# EAGLE design lolo4-rc2 (EAGLE 7.6.0)
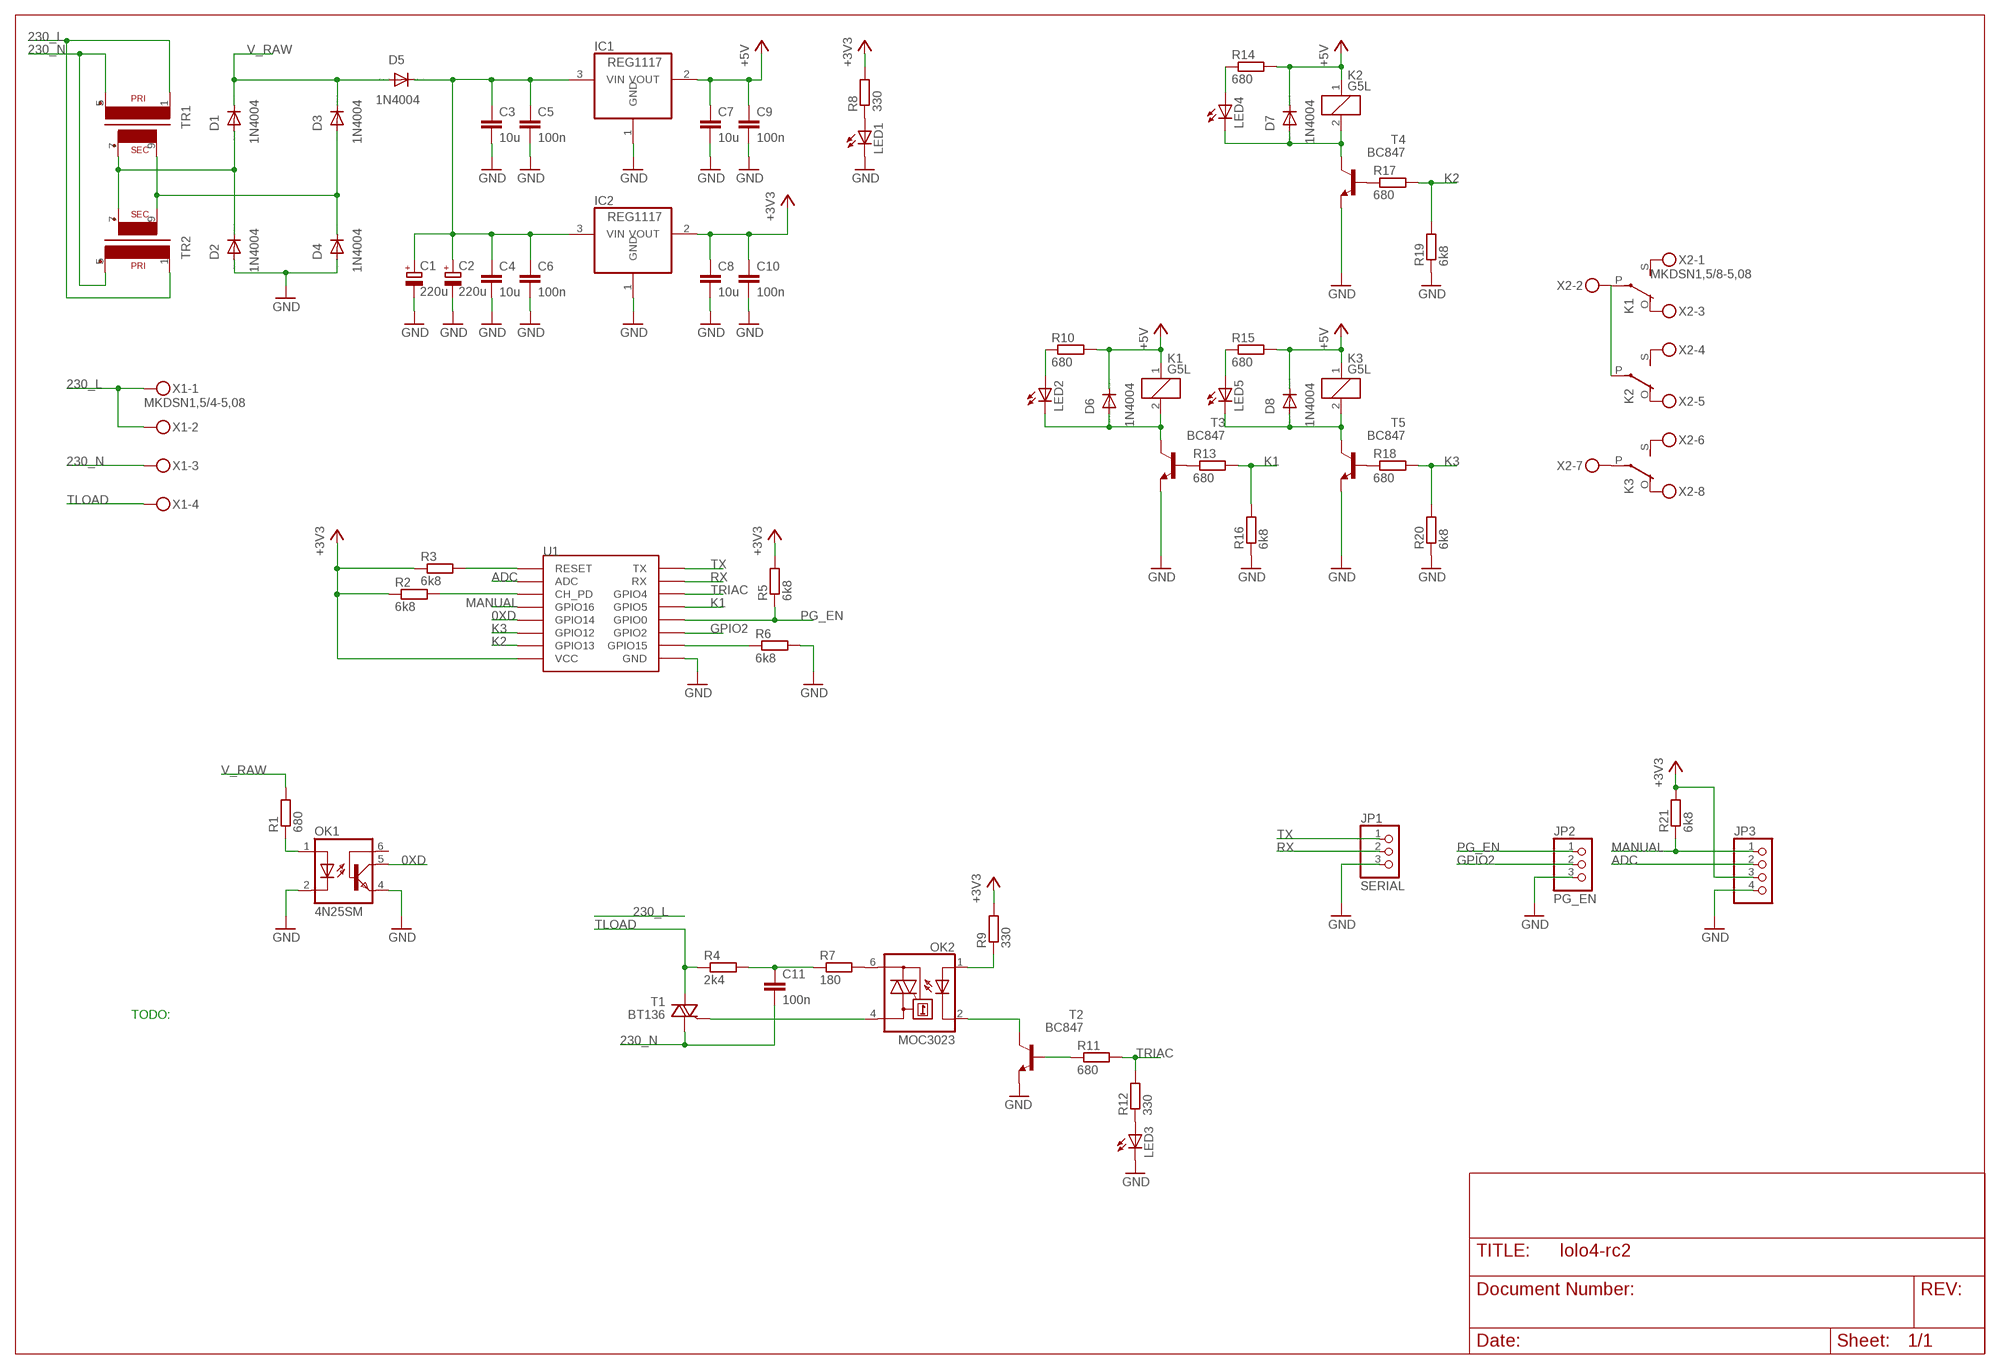
[diagram p0: schematic, sheet 1]

## Parts
C1  220u  CPOL-EUSANYO_SMD_E7  [SANYO-OSCON_SMD_E7]
C2  220u  CPOL-EUSANYO_SMD_E7  [SANYO-OSCON_SMD_E7]
C3  10u  C-EUC1206  [C1206]
C4  10u  C-EUC1206  [C1206]
C5  100n  C-EUC1206  [C1206]
C6  100n  C-EUC1206  [C1206]
C7  10u  C-EUC1206  [C1206]
C8  10u  C-EUC1206  [C1206]
C9  100n  C-EUC1206  [C1206]
C10  100n  C-EUC1206  [C1206]
C11  100n  C-EU150-054X183  [C150-054X183]
D1  1N4004  [DO41-10]
D2  1N4004  [DO41-10]
D3  1N4004  [DO41-10]
D4  1N4004  [DO41-10]
D5  1N4004  [DO41-10]
D6  1N4004  [DO41-10]
D7  1N4004  [DO41-10]
D8  1N4004  [DO41-10]
IC1  REG1117  [SOT223]
IC2  REG1117  [SOT223]
JP1  SERIAL  PINHD-1X3  [1X03]
JP2  PG_EN  PINHD-1X3  [1X03]
JP3  PINHD-1X4  [1X04]
K1  G5L  [G5LE]
K2  G5L  [G5LE]
K3  G5L  [G5LE]
LED1  LEDSML1206  [SML1206]
LED2  LEDSML1206  [SML1206]
LED3  LEDSML1206  [SML1206]
LED4  LEDSML1206  [SML1206]
LED5  LEDSML1206  [SML1206]
OK1  4N25SM  [DIL6-SMD]
OK2  MOC3023  MOC3031S  [DIL6-SMD]
R1  680  R-EU_R1206  [R1206]
R2  6k8  R-EU_R1206  [R1206]
R3  6k8  R-EU_R1206  [R1206]
R4  2k4  R-EU_0207/7  [0207/7]
R5  6k8  R-EU_R1206  [R1206]
R6  6k8  R-EU_R1206  [R1206]
R7  180  R-EU_0207/7  [0207/7]
R8  330  R-EU_R1206  [R1206]
R9  330  R-EU_R1206  [R1206]
R10  680  R-EU_R1206  [R1206]
R11  680  R-EU_R1206  [R1206]
R12  330  R-EU_R1206  [R1206]
R13  680  R-EU_R1206  [R1206]
R14  680  R-EU_R1206  [R1206]
R15  680  R-EU_R1206  [R1206]
R16  6k8  R-EU_R1206  [R1206]
R17  680  R-EU_R1206  [R1206]
R18  680  R-EU_R1206  [R1206]
R19  6k8  R-EU_R1206  [R1206]
R20  6k8  R-EU_R1206  [R1206]
R21  6k8  R-EU_R1206  [R1206]
T1  BT136  [TO220AB]
T2  BC847  [SOT23]
T3  BC847  [SOT23]
T4  BC847  [SOT23]
T5  BC847  [SOT23]
TR1  VR11  [VR11]
TR2  VR11  [VR11]
U1  ESP12SMD  [ESP12-SMD]
X1  MKDSN1,5/4-5,08  [MKDSN1,5/4-5,08]
X2  MKDSN1,5/8-5,08  [MKDSN1,5/8-5,08]

## Nets
0XD: OK1.5(COL) U1.GPIO14
230_L: TR1.1 TR2.1 X1.1 X1.2
230_N: C11.2 T1.1(A1) TR1.5(P2) TR2.5(P2) X1.3
+3V3: C8.1 C10.1 IC2.2(VOUT) JP3.3 R2.1 R3.1 R5.2 R8.2 R9.2 R21.2 U1.VCC
+5V: C7.1 C9.1 D6.C D7.C D8.C IC1.2(VOUT) K1.1 K2.1 K3.1 R10.2 R14.2 R15.2
ADC: JP3.2 U1.ADC
GND: C1.- C2.- C3.2 C4.2 C5.2 C6.2 C7.2 C8.2 C9.2 C10.2 D2.A D4.A IC1.1(GND) IC2.1(GND) JP1.3 JP2.3 JP3.4 LED1.C LED3.C OK1.2(C) OK1.4(EMI) R6.2 R16.1 R19.1 R20.1 T2.2(E) T3.2(E) T4.2(E) T5.2(E) U1.GND
GPIO2: JP2.2 U1.GPIO2
K1: R13.2 R16.2 U1.GPIO5
K2: R17.2 R19.2 U1.GPIO13
K3: R18.2 R20.2 U1.GPIO12
MANUAL: JP3.1 R21.1 U1.GPIO16
N$1: K1.S(2:S) X2.1
N$2: K1.P(2:P) K2.P(2:P) X2.2
N$3: K1.O(2:O) X2.3
N$4: K2.S(2:S) X2.4
N$5: K2.O(2:O) X2.5
N$6: K3.P(2:P) X2.7
N$7: K3.S(2:S) X2.6
N$8: LED1.A R8.1
N$9: K3.O(2:O) X2.8
N$10: D1.A D2.C TR1.7(S3) TR2.7(S3)
N$11: D3.A D4.C TR1.9(S4) TR2.9(S4)
N$12: R2.2 U1.CH_PD
N$13: R6.1 U1.GPIO15
N$14: R3.2 U1.RESET
N$15: LED3.A R12.1
N$16: R13.1 T3.1(B)
N$18: R18.1 T5.1(B)
N$19: D7.A K2.2 LED4.C T4.3(C)
N$20: LED4.A R14.1
N$21: R17.1 T4.1(B)
N$23: D6.A K1.2 LED2.C T3.3(C)
N$25: OK1.1(A) R1.1
N$26: R11.1 T2.1(B)
N$27: D8.A K3.2 LED5.C T5.3(C)
N$28: LED2.A R10.1
N$29: OK2.4(A1) T1.3(G)
N$30: OK2.6(A2) R7.2
N$33: C11.1 R4.2 R7.1
N$34: OK2.2(C) T2.3(C)
N$35: OK2.1(A) R9.1
N$47: LED5.A R15.1
PG_EN: JP2.1 R5.1 U1.GPIO0
RX: JP1.2 U1.RXD0(RX)
TLOAD: R4.1 T1.2(A2) X1.4
TRIAC: R11.2 R12.2 U1.GPIO4
TX: JP1.1 U1.TXD0(TX)
V: C1.+ C2.+ C3.1 C4.1 C5.1 C6.1 D5.C IC1.3(VIN) IC2.3(VIN)
V_RAW: D1.C D3.C D5.A R1.2
Unconnected: OK1.6(BAS)

## Notes on the sheet
- TODO:

## Library data of the parts
C1 C2 = rcl:CPOL-EU: POLARIZED CAPACITOR, European symbol
C3-C10 = resistor:C-EU: CAPACITOR, European symbol
C11 = rcl:C-EU: CAPACITOR, European symbol
D1-D8 = diode:1N4004: DIODE general purpose rectifier, 1 A
IC1 IC2 = burr-brown:REG1117: 800mA and 1A Low Dropout (LDO) Positive Regulator 1.8V, 2.5V, 2.85V, 3.3V, 5V, and Adj; MPN: REG1117; OC_FARNELL: 1097566; OC_NEWARK: 14P6981
JP1 JP2 = pinhead:PINHD-1X3: PIN HEADER; OC_NEWARK: unknown
JP3 = pinhead:PINHD-1X4: PIN HEADER
K1-K3 = relay:G5L: RELAY 1 x switch, 10 A/120 V AC, 8 A/30 V ADC, Omron; OC_FARNELL: unknown; OC_NEWARK: unknown
LED1-LED5 = led:LED: LED OSRAM: - CHIPLED LG R971, LG N971, LY N971, LG Q971, LY Q971, LO R971, LY R971 LH N974, LH R974 LS Q976, LO Q976, LY Q976 LO Q996 - Hyper CHIPLED LW Q18S LB Q993, LB Q99A, LB R99A - SideLED LS A670, LO A670, LY A670, LG A670, LP A670 LB A673, LV A673, LT A673, LW A673 LH A674 LY A675 LS A676, LA A676, LO A676, LY A676, LW A676 LS A679, LY A679, LG A679 - Hyper Micro SIDELED® LS Y876, LA Y876, LO Y876, LY Y876 LT Y87S - SmartLED LW L88C, LW L88S LB L89C, LB L89S, LG L890 LS L89K, LO L89K, LY L89K LS L896, LA L896, LO L896, LY L896 - TOPLED LS T670, LO T670, LY T670, LG T670, LP T670 LSG T670, LSP T670, LSY T670, LOP T670, LYG T670 LG T671, LOG T671, LSG T671 LB T673, LV T673, LT T673, LW T673 LH T674 LS T676, LA T676, LO T676, LY T676, LB T676, LH T676, LSB T676, LW T676 LB T67C, LV T67C, LT T67C, LS T67K, LO T67K, LY T67K, LW E67C LS E67B, LA E67B, LO E67B, LY E67B, LB E67C, LV E67C, LT E67C LW T67C LS T679, LY T679, LG T679 LS T770, LO T770, LY T770, LG T770, LP T770 LB T773, LV T773, LT T773, LW T773 LH T774 LS E675, LA E675, LY E675, LS T675 LS T776, LA T776, LO T776, LY T776, LB T776 LHGB T686 LT T68C, LB T68C - Hyper Mini TOPLED® LB M676 - Mini TOPLED Santana® LG M470 LS M47K, LO M47K, LY M47K Source: http://www.osram.convergy.de LUXEON: - LUMILED® LXK2-PW12-R00, LXK2-PW12-S00, LXK2-PW14-U00, LXK2-PW14-V00 LXK2-PM12-R00, LXK2-PM12-S00, LXK2-PM14-U00 LXK2-PE12-Q00, LXK2-PE12-R00, LXK2-PE12-S00, LXK2-PE14-T00, LXK2-PE14-U00 LXK2-PB12-K00, LXK2-PB12-L00, LXK2-PB12-M00, LXK2-PB14-N00, LXK2-PB14-P00, LXK2-PB14-Q00 LXK2-PR12-L00, LXK2-PR12-M00, LXK2-PR14-Q00, LXK2-PR14-R00 LXK2-PD12-Q00, LXK2-PD12-R00, LXK2-PD12-S00 LXK2-PH12-R00, LXK2-PH12-S00 LXK2-PL12-P00, LXK2-PL12-Q00, LXK2-PL12-R00 Source: www.luxeon.com KINGBRIGHT: KA-3528ASYC Source: www.kingbright.com
OK1 = optocoupler:4N*?M: General Purpose 6-Pin Phototransistor Optocouplers Source: http://www.fairchildsemi.com/ds/4N/4N35-M.pdf; MF: FAIRCHILD SEMICONDUCTOR; MPN: 4N25SM; OC_FARNELL: 1021152; OC_NEWARK: 34C2020
OK2 = optocoupler:MOC30*: 6-Pin DIP Zero-Cross Optoisolators Triac Driver Output (250/400 Volt Peak) Source: Data sheet <http://www.fairchildsemi.com/ds/MO/MOC3031M.pdf> The old path of data sheet not more available 2013-05-06.; MF: FAIRCHILD SEMICONDUCTOR; MPN: MOC3031SM; OC_FARNELL: unknown; OC_NEWARK: 34C1335
R1-R21 = resistor:R-EU_: RESISTOR, European symbol
T1 = triac:BT136: Triac BT136 series E sensitive gate Source: http://www.nxp.com/acrobat_download/datasheets/BT136_SERIES_E_2.pdf
T2-T5 = transistor:BC847: NPN TRANSISTOR
TR1 TR2 = trafo:VR11: TRANSFORMER 1 primary winding, 1 secondary winding BLOCK
U1 = esp8266modules:ESP12: ESP8266 Wifi module 12
X1 = con-phoenix-508:MKDSN1,5/4-5,08: MKDSN 1,5/ 4-5,08 Printklemme Nennstrom: 13,5 A Nennspannung: 250 V Rastermaß: 5,08 mm Polzahl: 4 Anschlussart: Schraubanschluss Montage: Löten Anschlussrichtung Leiter/Platine: 0 ° Artikelnummer: 1729144 Source: http://eshop.phoenixcontact.com .. 1729144.pdf
X2 = con-phoenix-508:MKDSN1,5/8-5,08: MKDSN 1,5/ 8-5,08 Printklemme Nennstrom: 13,5 A Nennspannung: 250 V Rastermaß: 5,08 mm Polzahl: 8 Anschlussart: Schraubanschluss Montage: Löten Anschlussrichtung Leiter/Platine: 0 ° Artikelnummer: 1729186 Source: http://eshop.phoenixcontact.com .. 1729186.pdf

## Board
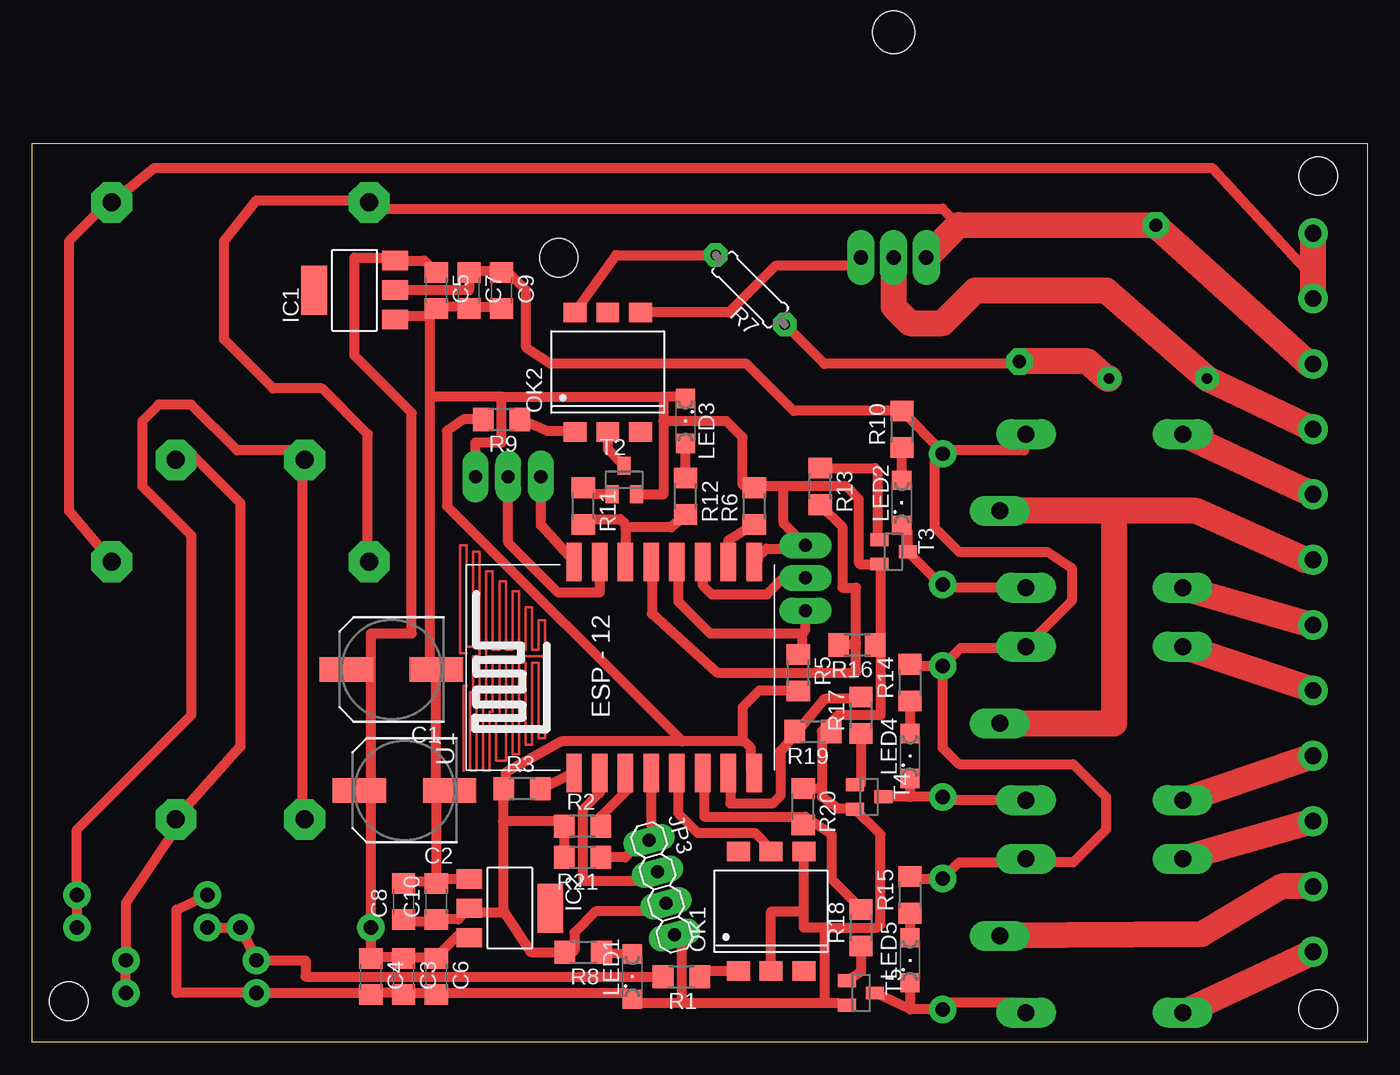
[diagram p1: board, top side]
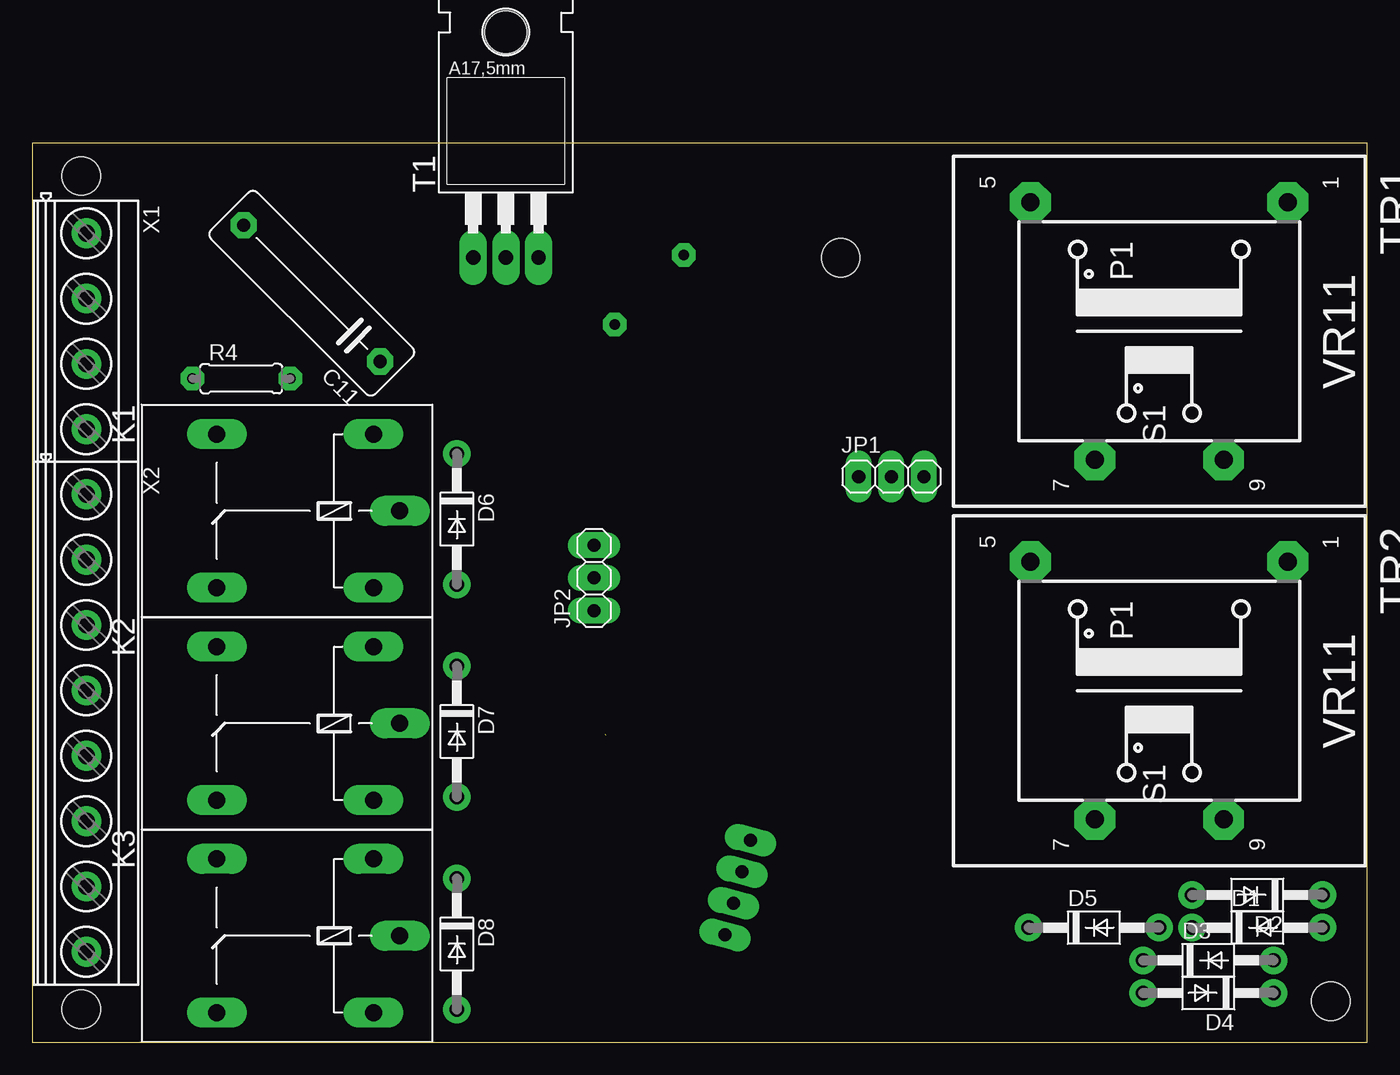
[diagram p2: board, bottom side, seen from below]

Size 103.81 x 69.84 mm. Coordinates in mm from the lower left corner, seen from the top.
Outline: 103.81,0 0,0 0,69.84 103.81,69.84 103.81,0
Copper layers (1*16): Top 0.035mm / dielectric 1.5mm / Bottom 0.035mm
Design rules "default *": minimum track width 30mil, minimum drill 24mil, track to track 8mil, track to pad 8mil, pad to pad 8mil, via to via 8mil, smd to smd 8mil, copper to edge 40mil, drill to drill 8mil, minimum pad ring 20mil, minimum via ring 8mil, stop-mask expansion 4mil, vias tented up to drill 0mil, thermal gap 10mil
Holes 3 mm at 100,67.31 100,2.54 40.95,60.96 2.85,3.17

### Footprints (pad centres in the part's own frame; a part is rotated, then mirrored left to right if it is on the bottom)
SANYO-OSCON_SMD_E7 = smd 4.15 x 1.9: + 3.5,0; - -3.5,0
C1206 = smd 1.6 x 1.8: 1 -1.4,0; 2 1.4,0
C150-054X183 = drill 1.016 octagon: 1 -7.493,0; 2 7.493,0
DO41-10 = drill 1.118: A 5.08,0; C -5.08,0
SOT223 = smd 1.499 x 2.007: 1 -2.261,-3.15; 2 0.025,-3.15; 3 2.311,-3.15 | smd 3.81 x 2.007: 4 0,3.15
1X03 = drill 1.016 long: 1 -2.54,0; 2 0,0; 3 2.54,0
1X04 = drill 1.016 long: 1 -3.81,0; 2 -1.27,0; 3 1.27,0; 4 3.81,0
G5LE = drill 1.321 long: 1 -7.493,-5.969; 2 -7.493,5.969; O 4.699,5.969; P -9.525,0; S 4.699,-5.969
SML1206 = smd 1.5 x 1.5: A 1.75,0; C -1.75,0
DIL6-SMD = smd 1.78 x 1.52: 1 -2.54,-4.645; 2 0,-4.645; 3 2.54,-4.645; 4 2.54,4.645; 5 0,4.645; 6 -2.54,4.645
R1206 = smd 1.6 x 1.803: 1 -1.422,0; 2 1.422,0
0207/7 = drill 0.813 octagon: 1 -3.81,0; 2 3.81,0
TO220AB = drill 1.118 long: 1 -2.54,-6.35; 2 0,-6.35; 3 2.54,-6.35 | hole 3.302: 0,11.176
SOT23 = smd 1 x 1.4: 1 -0.95,-1.1; 2 0.95,-1.1; 3 0,1.1
VR11 = drill 1.397 pad 3.175 octagon: 1 -10.008,10.008; 5 -10.008,-10.008; 7 10.008,-5.004; 9 10.008,5.004
ESP12-SMD = smd 3 x 1.2: ADC -8.3,3.8; CH_PD -8.3,1.8; GND 8.1,-8.2; GPIO0 8.1,-2.2; GPIO2 8.1,-4.2; GPIO4 8.1,1.8; GPIO5 8.1,-0.2; GPIO12 -8.3,-4.2; GPIO13 -8.3,-6.2; GPIO14 -8.3,-2.2; GPIO15 8.1,-6.2; GPIO16 -8.3,-0.2; RESET -8.3,5.8; RXD0 8.1,3.8; TXD0 8.1,5.8; VCC -8.3,-8.2
MKDSN1,5/4-5,08 = drill 1.3 pad 2: 1 -7.641,0.025; 2 -2.561,0.025; 3 2.519,0.025; 4 7.599,0.025
MKDSN1,5/8-5,08 = drill 1.3 pad 2: 1 -17.801,0.025; 2 -12.721,0.025; 3 -7.641,0.025; 4 -2.561,0.025; 5 2.519,0.025; 6 7.599,0.025; 7 12.679,0.025; 8 17.759,0.025

### Placement (x,y rotation side)
C1  27.94,28.96 180 top
C2  28.96,19.56 180 top
C3  28.88,5.08 270 top
C4  26.34,5.08 270 top
C5  31.42,58.42 270 top
C6  31.42,5.08 270 top
C7  33.96,58.42 270 top
C8  28.88,10.92 90 top
C9  36.5,58.42 270 top
C10  31.42,10.92 90 top
C11  82.06,58.19 135 bottom
D1  8.56,8.89 0 bottom
D2  8.56,11.43 180 bottom
D3  12.37,6.35 0 bottom
D4  12.37,3.81 180 bottom
D5  21.26,8.89 0 bottom
D6  70.79,40.64 270 bottom
D7  70.79,24.13 270 bottom
D8  70.79,7.62 270 bottom
IC1  25.07,58.42 90 top
IC2  37.13,10.41 270 top
JP1  37.01,43.94 0 bottom
JP2  60.12,36.07 90 bottom
JP3  48.95,12.01 285 top
K1  84.76,41.27 180 bottom
K2  84.76,24.77 180 bottom
K3  84.76,8.26 180 bottom
LED1  46.66,5.08 90 top
LED2  67.62,41.91 90 top
LED3  50.8,48.26 270 top
LED4  68.25,22.23 90 top
LED5  68.25,6.35 90 top
OK1  57.45,10.16 0 top
OK2  44.76,52.07 0 top
R1  50.47,5.08 180 top
R2  42.8,16.76 0 top
R3  38.1,19.68 0 top
R4  87.55,51.56 0 bottom
R5  59.56,28.7 270 top
R6  56.13,41.66 90 top
R7  55.83,58.47 135 top
R8  42.85,6.99 180 top
R9  36.5,48.39 180 top
R10  67.62,47.62 90 top
R11  42.85,41.66 270 top
R12  50.8,42.42 270 top
R13  61.27,43.18 270 top
R14  68.25,27.94 90 top
R15  68.25,11.43 90 top
R16  64.14,30.86 180 top
R17  64.44,25.4 90 top
R18  64.44,8.89 90 top
R19  60.71,24.13 180 top
R20  59.94,18.29 270 top
R21  42.8,14.35 180 top
T1  66.98,67.31 0 bottom
T2  46.02,43.69 0 top
T3  66.98,38.1 270 top
T4  65.08,19.05 270 top
T5  64.44,3.81 270 top
TR1  16.18,55.24 270 bottom
TR2  16.18,27.3 270 bottom
U1  47.93,29.21 90 top
X1  99.62,55.22 270 bottom
X2  99.62,24.77 270 bottom

### Tracks (layer width: path | path; a pad name or v marks a point on that pad's centre or on a via)
0XD
  Top 0.762: OK1.5 57.46,14.99 56.19,16.26 51.74,16.26 50.22,17.78 50.22,20.83 U1.GPIO14
230_L
  Top 0.762: 6.02,38.1 TR2.1 2.85,41.27 2.85,62.23 6.02,65.41 6.02,65.53 TR1.1 9.5,67.94 91.75,67.94 99.47,59.59 X1.1
  Top 2.032: X1.2 X1.1
230_N
  Top 0.762: TR2.5 26.09,38.1 26.09,47.24 22.53,50.8 18.72,50.8 14.91,54.61 14.91,62.23 17.45,65.41 25.71,65.41 TR1.5 27.46,64.77 70.79,64.77 72.06,63.5
  Top 2.032: T1.1 72.06,63.5 C11.2 87.3,63.5 99.24,52.7 99.45,52.7 X1.3
+3V3
  Top 0.762: C8.1 28.88,9.4 31.42,9.4 C10.1 33.12,9.52 IC2.2 34.28,10.09 36.72,10.09 | R8.2 38.79,6.99 36.72,10.09 | 36.72,10.09 36.6,10.28 36.6,17.14 | 41.58,6.86 R8.2 | 36.6,17.14 36.6,19.77 R3.1 36.83,20.95 41.15,23.37 50.55,23.37 | U1.VCC 55.88,21.16 55.88,22.86 55.37,23.37 55.25,23.37 | 55.25,23.37 50.55,23.37 | R5.2 59.54,27.3 56.52,27.3 55.25,26.04 55.25,23.37 | R9.2 33.53,48.39 32.26,47.5 32.26,41.66 50.55,23.37 | R21.2 R2.1 41,17.14 36.6,17.14 | JP3.3 48.66,10.16 43.82,10.16 42.16,8.51 42.16,7.11 42.04,6.99 R8.2
+5V
  Top 0.762: R15.2 68.25,12.7 D8.C 72.06,13.97 77.01,13.97 K3.1 77.52,13.97 80.95,13.97 83.49,16.51 83.49,19.05 80.95,21.59 72.06,21.59 70.79,22.86 D7.C | D7.C 68.25,29.21 R14.2 | D6.C 71.04,45.97 77.14,45.97 77.14,46.48 K1.1 | IC1.2 28.37,58.42 33.96,58.42 C7.1 33.96,59.94 36.5,59.94 C9.1 37.01,59.82 38.41,58.42 38.41,53.98 40.31,52.7 55.55,52.7 59.21,49.05 R10.2 70.79,45.87 D6.C | D7.C 72.19,30.61 77.14,30.61 K2.1 80.82,34.29 80.82,36.83 78.92,38.1 72.06,38.1 70.16,40.01 70.16,45.09 D6.C
ADC
  Top 0.762: U1.ADC 44.13,19.36 42.8,18.03 42.8,13.08 42.88,12.55 47.78,12.55 JP3.2
GND
  Top 0.762: 31.42,3.81 28.88,3.81 C3.2 28.63,3.81 26.34,3.81 | 31.42,3.81 C6.2 31.67,3.43 | 26.09,3.81 C4.2 26.34,3.81 | D2.A 11.23,10.29 11.23,3.81 D4.A 26.34,3.81 | C8.2 28.88,12.45 31.17,12.45 C10.2 | 34.47,12.45 IC2.1 31.77,12.68 C10.2 | 31.42,12.45 C10.2 | 50.47,3.05 46.94,3.05 LED1.C 46.18,3.81 31.42,3.81 | 50.47,3.05 61.65,3.05 | 61.65,3.05 62.54,3.05 T5.2 | 61.65,8.89 65.71,8.89 65.96,9.14 65.96,16.13 T4.2 63.66,18.16 62.66,18.16 61.39,19.05 61.39,19.81 | 61.65,3.05 61.65,8.89 | 65.96,30.99 65.96,37.07 T3.2 64.33,37.15 64.26,37.34 64.26,42.22 63.3,43.18 58.42,43.18 | 65.96,30.99 65.96,25.4 62.66,25.4 61.81,24.55 | OK1.2 57.46,10.16 60,10.16 | 60,10.16 OK1.4 | 61.65,8.89 60,8.89 60,10.16 | 56.06,37.34 U1.GND 56.31,37.59 | 30.91,56.39 30.91,50.16 | 30.91,50.16 30.91,28.96 C1.- 31.42,28.94 31.42,19.56 | 31.42,19.56 C10.2 | 36.5,50.16 36.5,46.61 34.47,46.61 JP1.3 | 49.07,50.16 49.07,48.26 | 49.07,48.26 49.07,42.55 49.03,42.59 T2.2 | C9.2 36.5,57.15 33.96,57.15 C7.2 33.71,57.15 31.42,57.15 | 31.42,57.15 30.91,56.39 | 30.91,56.39 28.37,56.39 IC1.1 | 31.42,57.15 C5.2 | 50.47,3.05 50.47,7.62 49.94,8.15 JP3.4 | 58.42,43.18 55.88,43.18 | 61.81,24.55 61.39,24.13 61.39,19.81 | C2.- 31.42,19.56 | LED3.C 50.65,50.16 49.07,50.16 | R6.2 55.88,43.18 | 56.31,37.59 56.44,37.47 | 55.88,43.18 55.25,43.31 55.25,46.99 53.98,48.26 49.07,48.26 | 36.5,50.16 30.91,50.16 | C10.2 31.75,12.65 31.75,12.7 | 36.5,50.16 49.07,50.16 | R20.1 61.29,19.71 61.39,19.81 | R16.1 65.96,30.99 | 58.42,43.18 58.42,40.31 JP2.3 60.45,38.61 60.71,38.35 57.07,38.35 56.31,37.59 | R19.1 61.81,24.45 61.81,24.55
GPIO2
  Top 0.762: U1.GPIO2 52.13,35.5 52.83,34.8 57.15,34.8 58.42,36.07 JP2.2
K1
  Top 0.762: 64.06,30.99 64.06,28.7 53.26,28.7 48.18,33.27 48.18,37.08 U1.GPIO5 | 64.06,30.99 64.06,35.31 62.99,35.31 62.99,40.03 R13.2 | R16.2 64.06,30.99
K2  (1 unrouted)
  Top 0.762: R17.2 64.44,26.67 61.6,26.67 59.21,23.85 58.17,22.61 58.17,19.13 57.58,18.54 54.28,18.54 54.28,21.34 U1.GPIO13 | 59.28,23.92 R19.2
K3
  Top 0.762: 60.58,17.21 60.12,17.53 52.25,17.53 52.25,20.83 U1.GPIO12 | 60.58,17.21 62.15,16.13 62.15,12.7 64.44,10.41 R18.2 | R20.2 60.24,16.87 60.58,17.21
MANUAL
  Top 0.762: U1.GPIO16 48.13,17.4 48.14,16.04 JP3.1 47.52,15.24 46.99,15.24 46.1,14.35 R21.1
N$1
  Top 2.032: X2.1 99.57,42.55 K1.S 90.86,47.24
N$2
  Top 2.032: X2.2 98.94,37.47 90.48,41.27 84.13,41.27 | 84.13,41.27 K1.P | K2.P 84.13,24.77 84.13,41.27
N$3
  Top 2.032: K1.O X2.3
N$4
  Top 2.032: X2.4 K2.S
N$5
  Top 2.032: K2.O X2.5
N$6
  Top 2.032: X2.7 97.18,12.09 90.93,8.38 K3.P
N$7
  Top 2.032: X2.6 K3.S
N$8
  Top 0.762: R8.1 LED1.A
N$9
  Top 2.032: K3.O X2.8
N$10
  Top 0.762: D1.A D2.C 3.48,16.51 12.37,25.4 12.37,39.37 8.56,43.18 8.56,48.26 9.83,49.53 12.37,49.53 15.93,45.97 21.01,45.97 TR1.7 21.01,45.72 21.01,18.03 TR2.7
N$11
  Top 0.762: TR1.9 11.1,45.72 12.37,45.72 16.18,41.91 16.18,22.94 TR2.9 | 11.1,18.29 TR2.9 | TR2.9 11.18,16.59 7.29,10.79 D3.A D4.C
N$12
  Top 0.762: U1.CH_PD 45.97,20.91 45.97,19.81 46.25,19.81 46.25,19.58 44.22,17.55 R2.2
N$13
  Top 0.762: R6.1 54.13,38.99 U1.GPIO15
N$14
  Top 0.762: U1.RESET 39.64,19.68 R3.2
N$15
  Top 0.762: R12.1 LED3.A
N$16
  Top 0.762: T3.1 65.71,39.12 65.71,44.45 65.56,44.6 R13.1
N$17
  Top 0.203: 33.78,30.23 33.27,30.23 33.27,38.61 33.78,38.61 33.78,30.73 34.29,30.73 34.29,38.1 34.8,38.1 34.8,29.97 34.29,29.97 34.29,27.18 34.04,27.18 34.04,21.08 34.54,21.08 34.54,26.67 34.8,26.67 34.8,29.46 35.31,29.46 35.31,26.16 35.05,26.16 35.05,21.08 35.56,21.08 35.56,25.65 35.81,25.65 35.81,29.46 36.32,29.46 36.32,25.15 36.07,25.15 36.07,21.84 36.83,21.84 36.83,29.46 37.34,29.46 37.34,22.35 37.85,22.35 37.85,29.46 38.35,29.46 38.35,23.11 38.86,23.11 38.86,29.46 39.37,29.46 39.37,23.62 39.88,23.62 39.88,29.97 35.31,29.97 35.31,36.58 35.81,36.58 35.81,30.48 36.32,30.48 36.32,35.81 36.83,35.81 36.83,30.48 37.34,30.48 37.34,35.05 37.85,35.05 37.85,30.48 38.35,30.48 38.35,33.78 38.86,33.78 38.86,30.48 39.37,30.48 39.37,32.77 39.88,32.77 39.88,30.48
N$18
  Top 0.762: R18.1 64.44,5.46 T5.1
N$19
  Top 0.762: D7.A 68.25,19.05 | 68.25,19.05 T4.3 | 71.04,19.3 D7.A | LED4.C 68.25,19.05 | K2.2 71.04,18.8 D7.A
N$20
  Top 0.762: R14.1 LED4.A
N$21
  Top 0.762: R17.1 64.44,20.07 T4.1
N$22
  Top 0.203: 33.78,27.69 33.53,27.69 33.53,21.08
N$23
  Top 0.762: K1.2 71.04,35.31 D6.A 70.62,35.56 T3.3 68.08,39.7 LED2.C
N$25
  Top 0.762: OK1.1 52.33,5.51 R1.1
N$26
  Top 0.762: T2.1 43.59,42.59 R11.1
N$27
  Top 0.762: 68.25,2.54 T5.3 | LED5.C 68.25,2.54 | 68.25,2.54 D8.A 71.04,3.05 77.14,3.05 K3.2
N$28
  Top 0.762: LED2.A R10.1
N$29
  Top 0.762: T1.3 63.81,60.33 57.79,60.33 54.18,56.72 OK2.4
N$30
  Top 0.762: OK2.6 45.39,61.16 R7.2
N$33
  Top 0.762: C11.1 77.14,53.34 76.51,52.7 61.6,52.7 R7.1 | R7.1
  Top 2.032: R4.2 83.57,51.56 82.04,52.89 C11.1
N$34
  Top 0.762: 44.76,47.24 OK2.2 44.76,46.06 T2.3
N$35
  Top 0.762: OK2.1 41.58,47.5 40.06,47.5 38.02,48.39 R9.1
N$47
  Top 0.762: R15.1 LED5.A
PG_EN
  Top 0.762: U1.GPIO0 50.22,37.08 50.22,34.24 52.71,31.75 59.87,31.75 | 59.87,31.75 59.87,30.45 R5.1 | 59.87,31.75 60.12,32 JP2.1
RX
  Top 0.762: U1.RXD0 44.13,34.92 40.89,34.92 37.01,38.81 JP1.2
TLOAD
  Top 2.032: T1.2 66.98,57.15 68.25,55.88 70.79,55.88 73.33,58.42 83.49,58.42 R4.1 X1.4
TRIAC
  Top 0.762: R11.2 43,40.64 45.72,40.64 46.13,40.23 46.13,40.01 | 46.13,40.01 U1.GPIO4 | R12.2 49.68,40.01 46.13,40.01
TX
  Top 0.762: U1.TXD0 39.55,40.15 JP1.1
V
  Top 0.762: 26.34,19.56 D5.C 26.34,6.86 26.59,6.86 C4.1 26.34,6.6 28.63,6.6 C3.1 28.88,6.6 31.42,6.6 C6.1 31.67,6.86 33.07,8.26 34.29,8.26 34.14,8.1 IC2.3 | 26.34,19.56 26.34,29.21 | 26.34,29.21 26.34,31.75 29.52,31.75 29.52,48.9 25.07,53.34 25.07,60.96 27.99,60.96 IC1.3 30.51,60.73 C5.1 | C2.+ 26.34,19.56 | C1.+ 26.34,29.21
V_RAW
  Top 0.762: D1.C D5.A D3.C 21.26,6.35 21.26,5.08 48.9,5.08 | R1.2 49.05,5.23 48.9,5.08 | 48.9,5.08 49.2,5.08